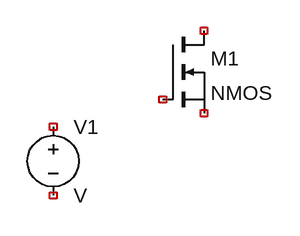
[diagram p0: schematic Draft2.asc]
Draft2.asc, the LTspice schematic file:
Version 4
SHEET 1 880 680
SYMBOL nmos 80 96 R0
SYMATTR InstName M1
SYMBOL voltage -48 192 R0
SYMATTR InstName V1

The netlist it stands for:
* Draft2.asc
M1 NC_01 NC_02 NC_03 NC_03 NMOS
V1 NC_04 NC_05 V
.model NMOS NMOS
.model PMOS PMOS
.lib standard.mos
.backanno
.end